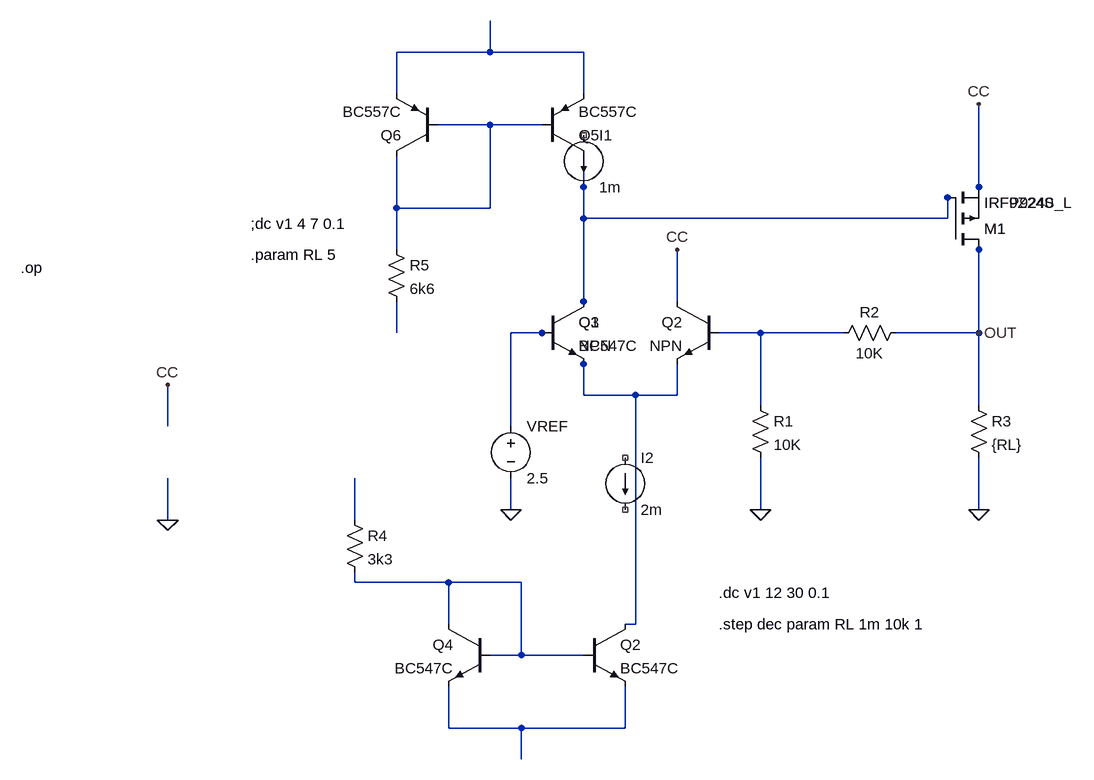
[diagram p0: schematic Regulador_Diferencial_MOS.asc]
Regulador_Diferencial_MOS.asc, the LTspice schematic file:
Version 4
SHEET 1 880 680
WIRE -48 -448 -48 -496
WIRE -48 -448 -192 -448
WIRE 96 -448 -48 -448
WIRE -192 -384 -192 -448
WIRE 96 -384 96 -448
WIRE -48 -336 -128 -336
WIRE 32 -336 -48 -336
WIRE 704 -240 704 -368
WIRE -192 -208 -192 -288
WIRE -48 -208 -48 -336
WIRE -48 -208 -192 -208
WIRE 96 -192 96 -288
WIRE 656 -192 656 -224
WIRE 656 -192 96 -192
WIRE -192 -144 -192 -208
WIRE 96 -64 96 -192
WIRE 240 -64 240 -144
WIRE -192 -16 -192 -64
WIRE 32 -16 -16 -16
WIRE 368 -16 304 -16
WIRE 496 -16 368 -16
WIRE 704 -16 704 -144
WIRE 704 -16 576 -16
WIRE 96 80 96 32
WIRE 176 80 96 80
WIRE 240 80 240 32
WIRE 240 80 176 80
WIRE 368 96 368 -16
WIRE 704 96 704 -16
WIRE -544 128 -544 64
WIRE -16 128 -16 -16
WIRE -16 256 -16 208
WIRE 368 256 368 176
WIRE 704 256 704 176
WIRE -544 272 -544 208
WIRE -256 272 -256 208
WIRE -256 368 -256 352
WIRE -112 368 -256 368
WIRE 0 368 -112 368
WIRE -112 432 -112 368
WIRE 176 432 176 80
WIRE 176 432 160 432
WIRE 0 480 0 368
WIRE 0 480 -48 480
WIRE 96 480 0 480
WIRE -112 592 -112 528
WIRE 0 592 -112 592
WIRE 160 592 160 528
WIRE 160 592 0 592
WIRE 0 640 0 592
FLAG 704 256 0
FLAG 368 256 0
FLAG -544 272 0
FLAG -544 64 CC
FLAG 704 -368 CC
FLAG -16 256 0
FLAG 240 -144 CC
FLAG 704 -16 OUT
WINDOW 123 0 0 Left 0
WINDOW 39 0 0 Left 0
SYMATTR InstName V1
SYMATTR Value 7
SYMBOL voltage -16 112 R0
WINDOW 123 0 0 Left 0
WINDOW 39 0 0 Left 0
SYMATTR InstName VREF
SYMATTR Value 2.5
SYMBOL res 352 80 R0
SYMATTR InstName R1
SYMATTR Value 10K
SYMBOL res 592 -32 R90
WINDOW 0 0 56 VBottom 2
WINDOW 3 32 56 VTop 2
SYMATTR InstName R2
SYMATTR Value 10K
SYMBOL res 688 80 R0
SYMATTR InstName R3
SYMATTR Value {RL}
<<<<<<< HEAD
SYMBOL current 160 176 R0
SYMATTR InstName I2
SYMATTR Value 2m
SYMBOL current 96 -320 R0
SYMATTR InstName I1
SYMATTR Value 1m
SYMBOL pmos 656 -144 M180
SYMATTR InstName M1
SYMATTR Value IRFP9240
SYMBOL npn 32 -64 R0
SYMATTR InstName Q1
SYMBOL npn 304 -64 M0
SYMATTR InstName Q2
TEXT 304 384 Left 2 !.dc v1 12 30 0.1
TEXT 304 432 Left 2 !.step dec param RL 1m 10k 1
=======
SYMBOL npn 32 -64 R0
SYMATTR InstName Q3
SYMATTR Value BC547C
SYMBOL pmos 656 -144 M180
SYMATTR InstName M1
SYMATTR Value IRF9Z24S_L
SYMBOL npn 96 432 R0
SYMATTR InstName Q2
SYMATTR Value BC547C
SYMBOL npn -48 432 M0
SYMATTR InstName Q4
SYMATTR Value BC547C
SYMBOL res -272 256 R0
SYMATTR InstName R4
SYMATTR Value 3k3
SYMBOL pnp 32 -288 M180
SYMATTR InstName Q5
SYMATTR Value BC557C
SYMBOL pnp -128 -288 R180
SYMATTR InstName Q6
SYMATTR Value BC557C
SYMBOL res -208 -160 R0
SYMATTR InstName R5
SYMATTR Value 6k6
TEXT -416 -184 Left 2 !;dc v1 4 7 0.1
TEXT -416 -136 Left 2 !.param RL 5
TEXT -770 -116 Left 2 !.op

The netlist it stands for:
* Regulador_Diferencial_MOS.asc
VREF N005 0 2.5
R1 N006 0 10K
R2 OUT N006 10K
R3 OUT 0 {RL}
I2 NC_01 NC_02 2m
I1 NC_03 N003 1m
M1 OUT N003 CC CC IRFP9240
Q1 N003 N005 N007 0 NPN
Q2 CC N006 N007 0 NPN
Q3 N003 N005 N007 0 BC547C
M1 OUT N003 CC CC IRF9Z24S_L
Q2 N007 N009 N010 0 BC547C
Q4 N009 N009 N010 0 BC547C
R4 N008 N009 3k3
Q5 N003 N002 N001 0 BC557C
Q6 N002 N002 N001 0 BC557C
R5 N002 N004 6k6
.model NPN NPN
.model PNP PNP
.lib standard.bjt
.model NMOS NMOS
.model PMOS PMOS
.lib standard.mos
.dc v1 12 30 0.1
.step dec param RL 1m 10k 1
;dc v1 4 7 0.1
.param RL 5
.op
.backanno
.end